# EasyEDA schematic Schematic - EasyEDA.json

## Sheets
1 Upper Schematic: TITLE: TickTockTubeClock - Upper PCB; REV: 1.0; Date: 2020-08-06; Sheet: 1/1; Drawn By: Andreas Tarnowsky; Company: N/A
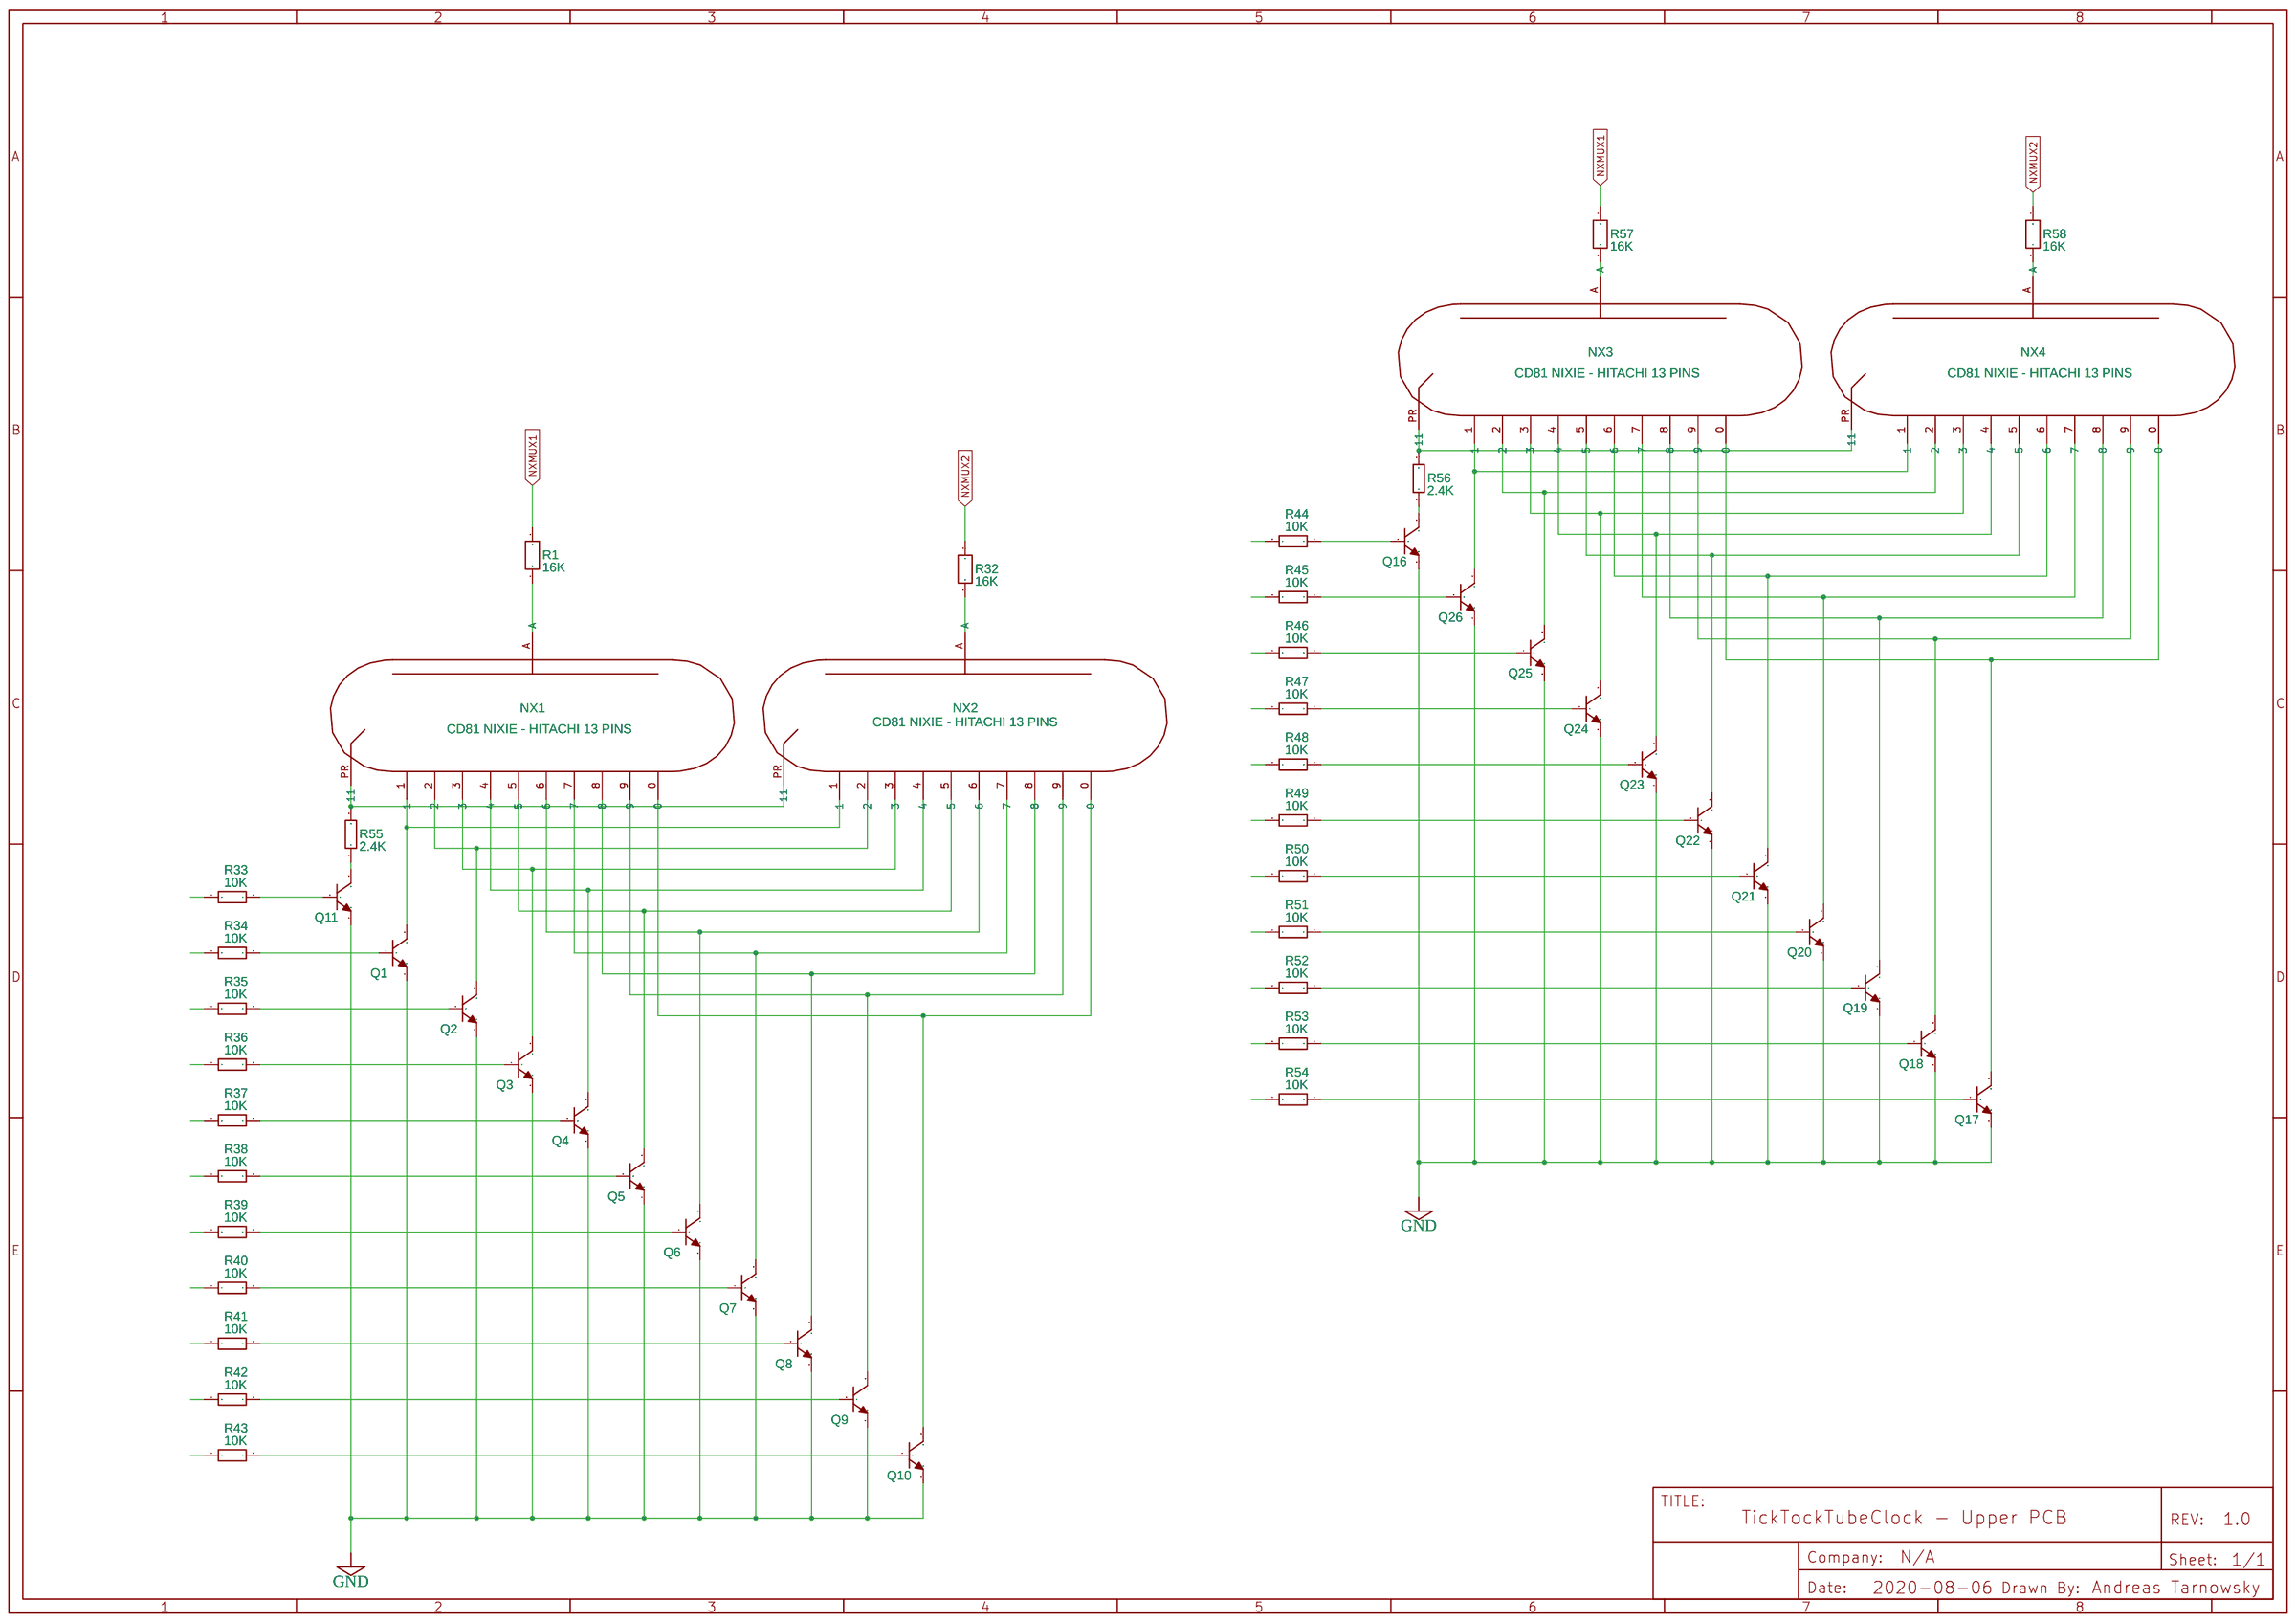
[diagram p0: Upper Schematic]
2 Lower Schematic: TITLE: TickTockTubeClock - Lower PCB; REV: 3.0; Date: 2022-03-27
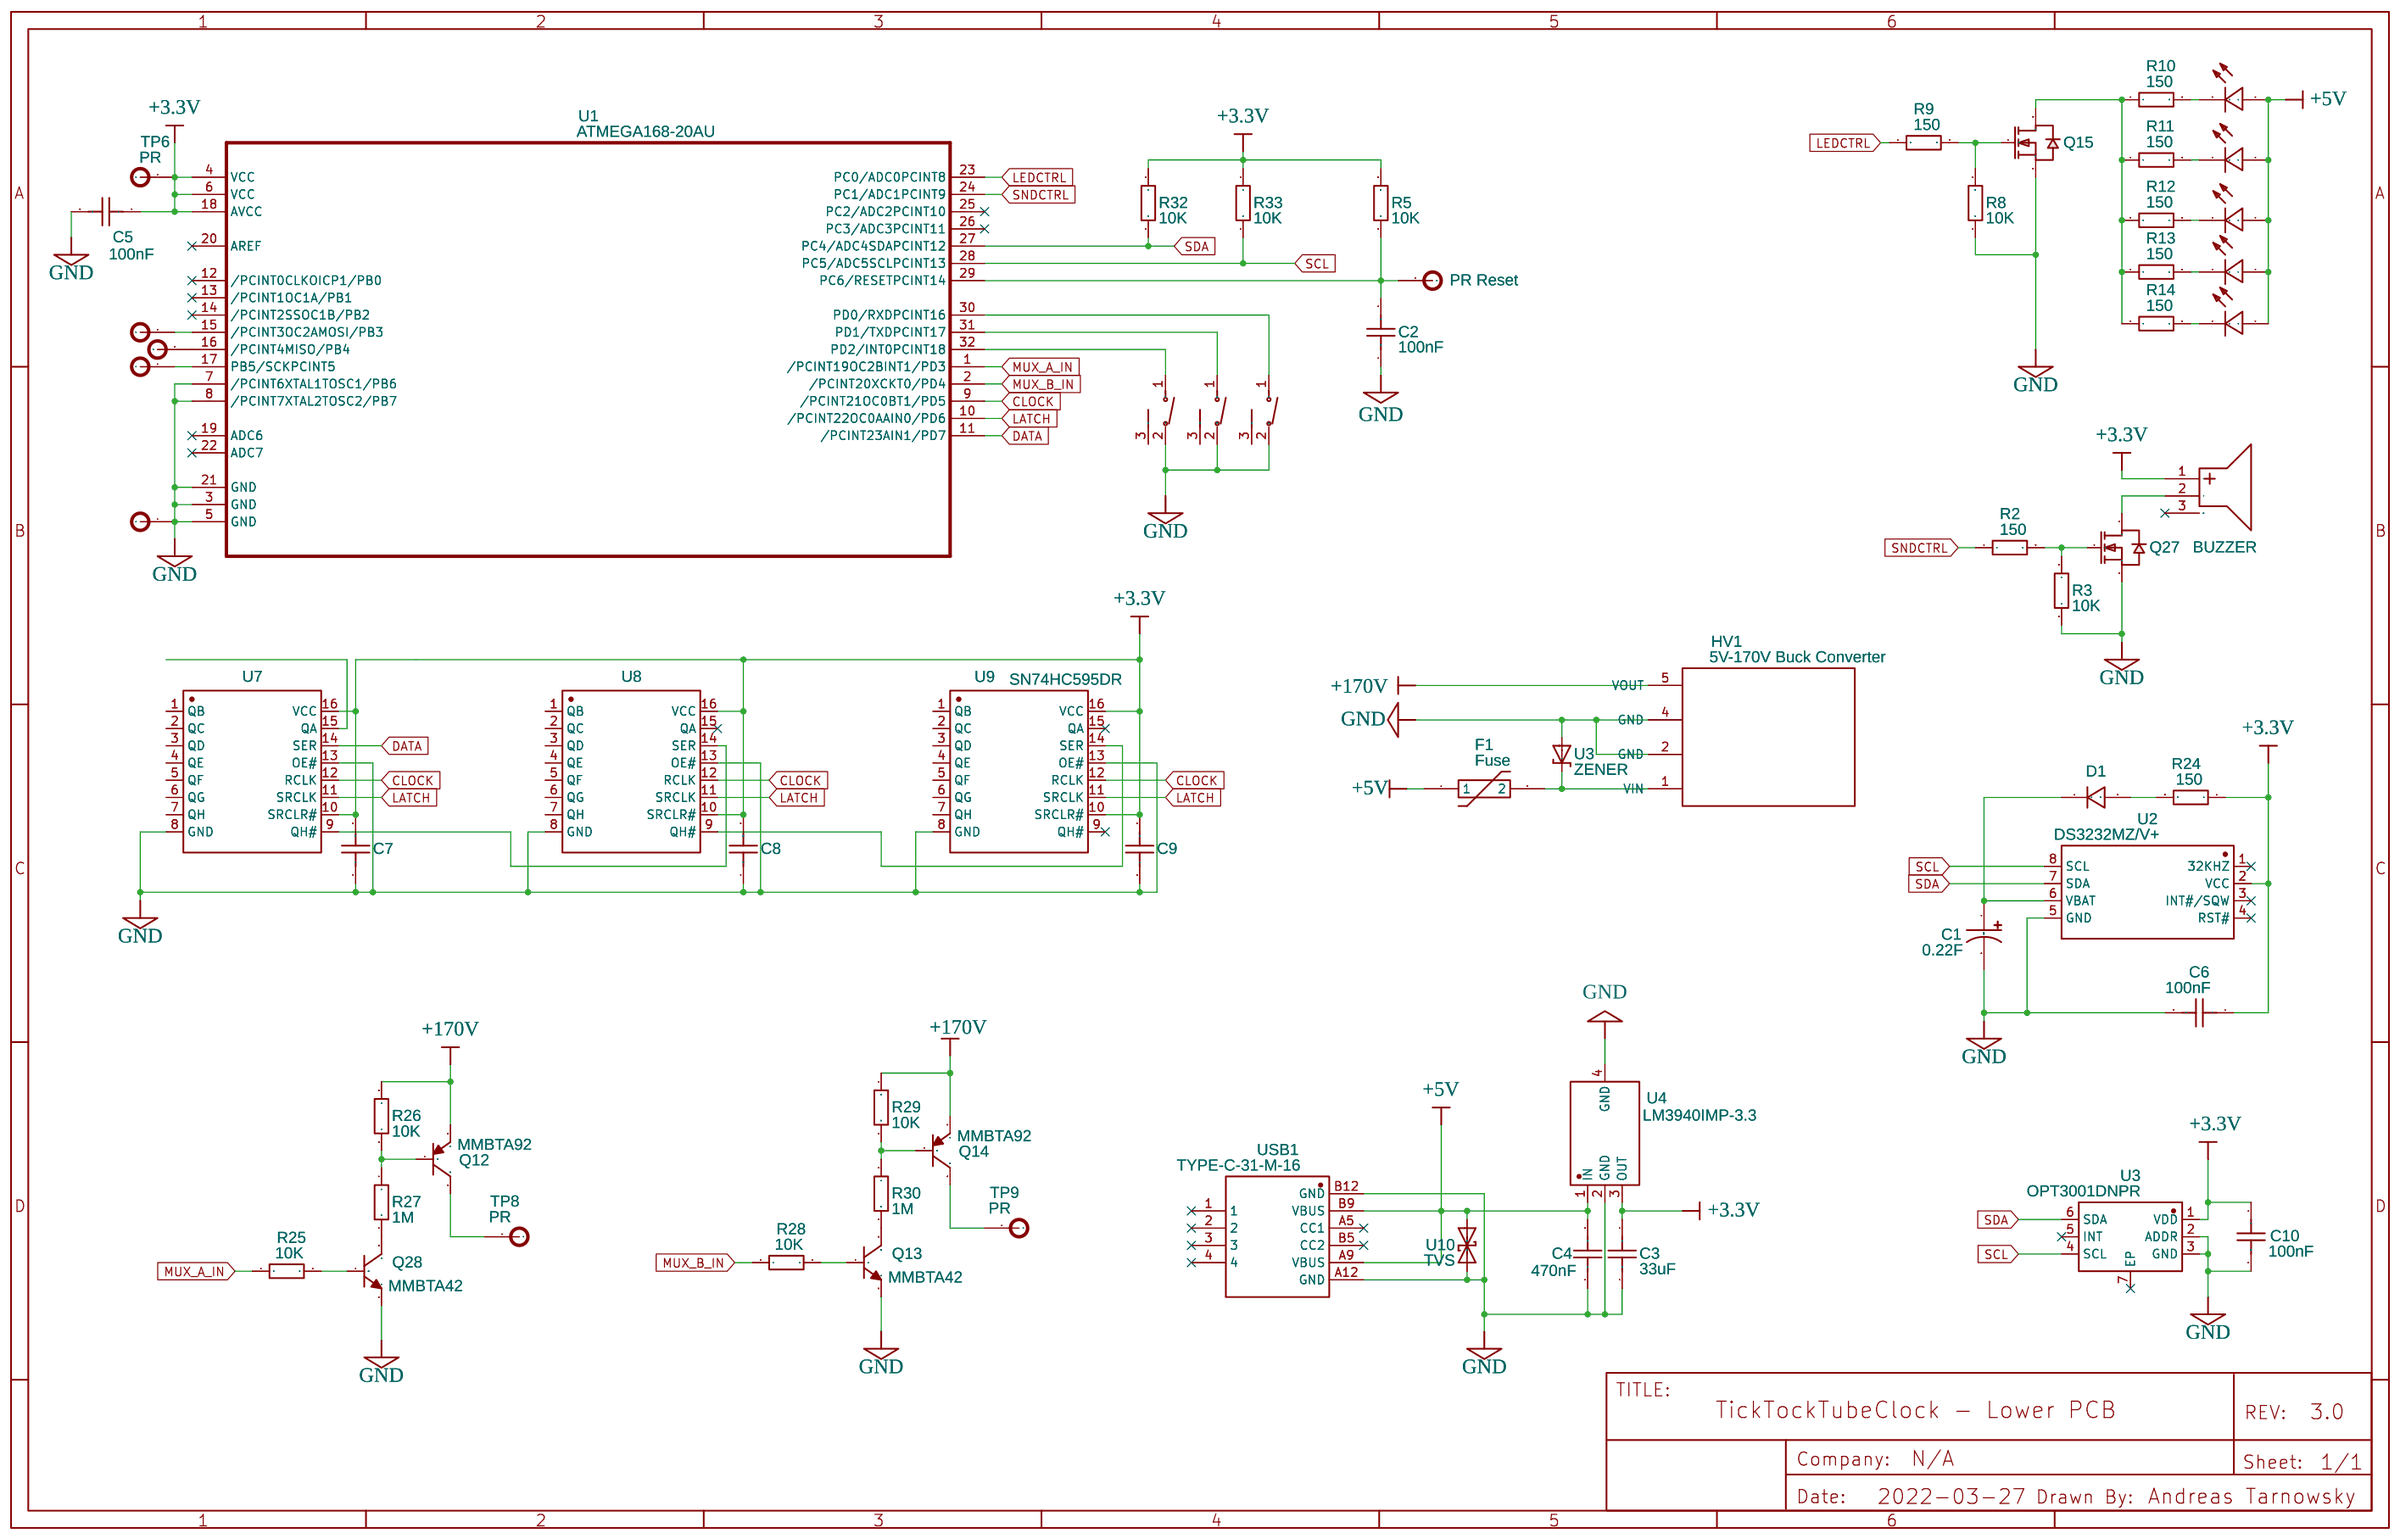
[diagram p1: Lower Schematic]

## Parts
sheet Lower Schematic
BUZZER  KLJ-5018  [BUZ-SMD_4P-L5.0-W5.0-P4.00-BR]
C1  0.22F  [GOLDCAP_SMD_10MM_ROUND]
C2  100nF  [C0603]
C3  33uF  [C1206]
C4  470nF  [C0805]
C5  100nF  [C0603]
C6  100nF  [C0603]
C7  100nF  [C0603]
C8  100nF  [C0603]
C9  100nF  [C0603]
C10  100nF  [C0603]
D1  1N4148W-13-F  [SOD-123_L2.8-W1.8-LS3.7-RD]
F1  Fuse  [LITTELFUSE_0805L100WR]
HV1  5V-170V Buck Converter  [HV_5V_170V_MINI]
LED1  17-21/S2C-FR1S2L/3T  [LED0805-R-RD]
LED2  17-21/S2C-FR1S2L/3T  [LED0805-R-RD]
LED3  17-21/S2C-FR1S2L/3T  [LED0805-R-RD]
LED4  17-21/S2C-FR1S2L/3T  [LED0805-R-RD]
LED5  17-21/S2C-FR1S2L/3T  [LED0805-R-RD]
Q12  MMBTA92  [SOT-23-3_L2.9-W1.3-P1.90-LS2.4-BR]
Q13  MMBTA42  [SOT-23-3_L2.9-W1.3-P1.90-LS2.4-BR]
Q14  MMBTA92  [SOT-23-3_L2.9-W1.3-P1.90-LS2.4-BR]
Q15  IRLML2502TRPBF  [SOT-23_L2.9-W1.3-P0.95-LS2.4-BR]
Q27  IRLML2502TRPBF  [SOT-23_L2.9-W1.3-P0.95-LS2.4-BR]
Q28  MMBTA42  [SOT-23-3_L2.9-W1.3-P1.90-LS2.4-BR]
R2  150  [R0805]
R3  10K  [R0805]
R5  10K  [R0805]
R8  10K  [R0805]
R9  150  [R0805]
R10  150  [R0805]
R11  150  [R0805]
R12  150  [R0805]
R13  150  [R0805]
R14  150  [R0805]
R24  150  [R0805]
R25  10K  [R0805]
R26  10K  [R0805]
R27  1M  [R0805]
R28  10K  [R0805]
R29  10K  [R0805]
R30  1M  [R0805]
R32#2  10K  [R0805]
R33#2  10K  [R0805]
SW1  TCD-C2KQR  [SW-SMD_TCD-C2KQR]
SW2  TCD-C2KQR  [SW-SMD_TCD-C2KQR]
SW3  TCD-C2KQR  [SW-SMD_TCD-C2KQR]
TP1  PR Reset  [TEST_PAD]
TP3  PR  [TEST_PAD]
TP4  PR  [TEST_PAD]
TP5  PR  [TEST_PAD]
TP6  PR  [TEST_PAD]
TP7  PR  [TEST_PAD]
TP8  PR  [TEST_PAD]
TP9  PR  [TEST_PAD]
U1  ATMEGA168-20AU  [TQFP32]
U2  DS3232MZ/V+  [SOIC-8_L4.9-W3.9-P1.27-LS6.0-BL]
U3  OPT3001DNPR  [USON6_L2.1-W2.1-P0.65-BL-EP]
U3#2  ZENER  [DIODE-ZENER]
U4  LM3940IMP-3.3  [SOT-223_L6.5-W3.5-P2.30-LS7.0-BR]
U7  SN74HC595DR  [SOIC-16_L9.9-W3.9-P1.27-LS6.0-BL]
U8  SN74HC595DR  [SOIC-16_L9.9-W3.9-P1.27-LS6.0-BL]
U9  SN74HC595DR  [SOIC-16_L9.9-W3.9-P1.27-LS6.0-BL]
U10  TVS  [SMA-DIODE]
USB1  TYPE-C-31-M-16  [TYPE-C-SMD_TYPE-C-31-M-16]
sheet Upper Schematic
NX1  CD81 NIXIE - HITACHI 13 PINS  [CD81 NIXIE - HITACHI 13PIN]
NX2  CD81 NIXIE - HITACHI 13 PINS  [CD81 NIXIE - HITACHI 13PIN]
NX3  CD81 NIXIE - HITACHI 13 PINS  [CD81 NIXIE - HITACHI 13PIN]
NX4  CD81 NIXIE - HITACHI 13 PINS  [CD81 NIXIE - HITACHI 13PIN]
Q1  MMBTA42  [SOT-23-3_L2.9-W1.6-P1.90-LS2.8-BR]
Q2  MMBTA42  [SOT-23-3_L2.9-W1.6-P1.90-LS2.8-BR]
Q3  MMBTA42  [SOT-23-3_L2.9-W1.6-P1.90-LS2.8-BR]
Q4  MMBTA42  [SOT-23-3_L2.9-W1.6-P1.90-LS2.8-BR]
Q5  MMBTA42  [SOT-23-3_L2.9-W1.6-P1.90-LS2.8-BR]
Q6  MMBTA42  [SOT-23-3_L2.9-W1.6-P1.90-LS2.8-BR]
Q7  MMBTA42  [SOT-23-3_L2.9-W1.6-P1.90-LS2.8-BR]
Q8  MMBTA42  [SOT-23-3_L2.9-W1.6-P1.90-LS2.8-BR]
Q9  MMBTA42  [SOT-23-3_L2.9-W1.6-P1.90-LS2.8-BR]
Q10  MMBTA42  [SOT-23-3_L2.9-W1.6-P1.90-LS2.8-BR]
Q11  MMBTA42  [SOT-23-3_L2.9-W1.6-P1.90-LS2.8-BR]
Q16  MMBTA42  [SOT-23-3_L2.9-W1.6-P1.90-LS2.8-BR]
Q17  MMBTA42  [SOT-23-3_L2.9-W1.6-P1.90-LS2.8-BR]
Q18  MMBTA42  [SOT-23-3_L2.9-W1.6-P1.90-LS2.8-BR]
Q19  MMBTA42  [SOT-23-3_L2.9-W1.6-P1.90-LS2.8-BR]
Q20  MMBTA42  [SOT-23-3_L2.9-W1.6-P1.90-LS2.8-BR]
Q21  MMBTA42  [SOT-23-3_L2.9-W1.6-P1.90-LS2.8-BR]
Q22  MMBTA42  [SOT-23-3_L2.9-W1.6-P1.90-LS2.8-BR]
Q23  MMBTA42  [SOT-23-3_L2.9-W1.6-P1.90-LS2.8-BR]
Q24  MMBTA42  [SOT-23-3_L2.9-W1.6-P1.90-LS2.8-BR]
Q25  MMBTA42  [SOT-23-3_L2.9-W1.6-P1.90-LS2.8-BR]
Q26  MMBTA42  [SOT-23-3_L2.9-W1.6-P1.90-LS2.8-BR]
R1  16K  [R0805]
R32  16K  [R0805]
R33  10K  [R0603]
R34  10K  [R0603]
R35  10K  [R0603]
R36  10K  [R0603]
R37  10K  [R0603]
R38  10K  [R0603]
R39  10K  [R0603]
R40  10K  [R0603]
R41  10K  [R0603]
R42  10K  [R0603]
R43  10K  [R0603]
R44  10K  [R0603]
R45  10K  [R0603]
R46  10K  [R0603]
R47  10K  [R0603]
R48  10K  [R0603]
R49  10K  [R0603]
R50  10K  [R0603]
R51  10K  [R0603]
R52  10K  [R0603]
R53  10K  [R0603]
R54  10K  [R0603]
R55  2.4K  [R0805]
R56  2.4K  [R0805]
R57  16K  [R0805]
R58  16K  [R0805]

## Library data of the parts
BUZZER = KLJ-5018: Supplier: Digi-Key; Supplier Part: 102-3743-1-ND; Manufacturer: CMT; Manufacturer Part: CMT-5023S-SMT-TR; Contributor: LCSC
C1 = GOLD-CAP MATSUSHITA GC5.5V0.10F: Manufacturer: Matsushita; Contributor: LCSC
C2 C5-C10 = C0603C104J5RAC: Supplier: LCSC; Supplier Part: C490602; Manufacturer: KEMET; Contributor: LCSC
C3 = C3216X5R1A336MTJ00N: Supplier: LCSC; Supplier Part: C342606; Manufacturer: TDK; Contributor: LCSC
C4 = GCM21BR71H474MA55L: Supplier: LCSC; Supplier Part: C161264; Manufacturer: Murata Electronics; Contributor: LCSC
D1 = 1N4148W-13-F: Supplier Part: C112342; Supplier: LCSC; Manufacturer: DIODES; Contributor: LCSC
F1 = Littelfuse 0805L100WR: Manufacturer: Littelfuse; Manufacturer Part: 0805L100WR; Supplier: LCSC; Supplier Part: C80270; link: https://lcsc.com/product-detail/Others_Littelfuse_0805L100WR_Littelfuse-0805L100WR_C80270.html; Contributor: EddieT76
HV1 = 5V-170V Buck Converter: Contributor: andreas.tarnowsky
LED1-LED5 = 17-21/S2C-FR1S2L/3T: Supplier: LCSC; Supplier Part: C264419; Manufacturer: Everlight Elec; Contributor: LCSC
Q12 Q14 = MMBTA92 2D: Supplier: LCSC; Manufacturer: CJ; image: //image.lceda.cn/szlcsc/C8516.jpg; Supplier Part: C8516; LCSC Assembly: Yes; SMT Type: Extend
Q13 Q28 = MMBTA42_C8515: Supplier: LCSC; Manufacturer: CJ; image: //image.lceda.cn/szlcsc/C8515.jpg; Supplier Part: C8515; LCSC Assembly: Yes; SMT Type: Extend
Q15 Q27 = IRLML2502TRPBF: Supplier: LCSC; Manufacturer: IR; image: //image.lceda.cn/szlcsc/C2589.jpg; Supplier Part: C2589; SMT Type: Extend; JLCPCB SMD: Yes
R2 R9-R14 = RMC08051501%N: Supplier: LCSC; Supplier Part: C325766; Manufacturer: Tyohm; Contributor: LCSC
R3 R5 R8 R25 R26 R28 R29 R32#2 R33#2 = 0805W8F1002T5E: Supplier: LCSC; Manufacturer: UniOhm; LCSC Assembly: Yes; Supplier Part: C17414; SMT Type: Basic
R24 = 0805W8F2400T5E: Supplier: LCSC; Manufacturer: UniOhm; LCSC Assembly: Yes; Supplier Part: C17572; SMT Type: Basic
R27 R30 = 0805W8F1002T5E: Supplier: LCSC; Manufacturer Part: 0805W8F1004T5E; Supplier Part: C17514; Manufacturer: UniOhm
SW1-SW3 = TCD-C2KQR: Supplier: LCSC; Supplier Part: C483805; Manufacturer: Diptronics; Contributor: LCSC
TP1 TP3-TP9 = Test Point Small: Manufacturer Part: Test_Pin; Contributor: linuxlism
U1 = ATMEGA168-20AU
U2 = DS3232MZ/V+: Supplier: LCSC; Manufacturer: MAXIM; Contributor: LCSC; Supplier Part: C143316; LCSC Assembly: Yes; SMT Type: Extend
U3 = OPT3001DNPR: Supplier: LCSC; Manufacturer: TI; Supplier Part: C90462; SMT Type: Extend; JLCPCB SMD: Yes
U3#2 = DIODE-ZENER: Contributor: SparkFun
U4 = LM3940IMP-3.3/NOPB: Supplier: LCSC; Supplier Part: C140319; Manufacturer: Texas Instruments; Contributor: LCSC; SMT Type: Extend; JLCPCB SMD: Yes
U7-U9 = SN74HC595DR: Supplier: LCSC; Manufacturer: TI; image: //image.lceda.cn/szlcsc/C10092.jpg; Supplier Part: C10092; SMT Type: Extend; JLCPCB SMD: Yes
U10 = TVS: Contributor: SparkFun
USB1 = TYPE-C-31-M-16: Supplier: LCSC; Supplier Part: C283541; Manufacturer: Korean Hroparts Elec; Contributor: LCSC
NX1-NX4 = CD81 NIXIE - HITACHI 13 PINS: Contributor: TomekZi
Q1-Q11 Q16-Q26 = MMBTA42LT1G: Supplier: LCSC; Manufacturer: ON; Supplier Part: C94389; LCSC Assembly: Yes; SMT Type: Extend
R1 R32 R57 R58 = ERJ6GEYJ163V: Supplier: LCSC; Supplier Part: C413203; Manufacturer: PANASONIC; Contributor: LCSC
R33-R54 = ERJPB3D1002V: Supplier: LCSC; Supplier Part: C189495; Manufacturer: PANASONIC; Contributor: LCSC
R55 R56 = ERJ6RBD2401V: Supplier: LCSC; Supplier Part: C336868; Manufacturer: PANASONIC; Contributor: LCSC

## Nets
+3.3V: BUZZER.1(+) C3.2 C5.1 C6.1 C7.2 C8.2 C9.2 C10.1 R5.2 R24.1 R32#2.2 R33#2.2 TP6.1 U1.4(VCC) U1.6(VCC) U1.18(AVCC) U2.2(VCC) U3.1(VDD) U4.3(OUT) U7.10(SRCLR#) U7.16(VCC) U8.10(SRCLR#) U8.16(VCC) U9.10(SRCLR#) U9.16(VCC)
+5V: C4.2 F1.1 LED1.1(A) LED2.1(A) LED3.1(A) LED4.1(A) LED5.1(A) U4.1(IN) U10.C(2) USB1.A9(VBUS) USB1.B9(VBUS)
+170V: HV1.5(VOUT) Q12.2(E) Q14.2(E) R26.1 R29.1
GND: C1.2 C2.1 C3.1 C4.1 C5.2 C6.2 C7.1 C8.1 C9.1 C10.2 HV1.2(GND) HV1.4(GND) Q1.2 Q2.2 Q3.2 Q4.2 Q5.2 Q6.2 Q7.2 Q8.2 Q9.2 Q10.2 Q11.2 Q13.2(E) Q15.2(S) Q16.2 Q17.2 Q18.2 Q19.2 Q20.2 Q21.2 Q22.2 Q23.2 Q24.2 Q25.2 Q26.2 Q27.2(S) Q28.2(E) R3.1 R8.1 SW1.2 SW2.2 SW3.2 TP7.1 U1.3(GND) U1.5(GND) U1.7(/PCINT6XTAL1TOSC1/PB6) U1.8(/PCINT7XTAL2TOSC2/PB7) U1.21(GND) U2.5(GND) U3.2(ADDR) U3.3(GND) U3#2.P$2(A) U4.2(GND) U4.4(GND) U7.8(GND) U7.13(OE#) U8.8(GND) U8.13(OE#) U9.8(GND) U9.13(OE#) U10.A(1) USB1.A12(GND) USB1.B12(GND)
CLOCK: U1.9(/PCINT21OC0BT1/PD5) U7.12(RCLK) U8.12(RCLK) U9.12(RCLK)
DATA: U1.11(/PCINT23AIN1/PD7) U7.14(SER)
LATCH: U1.10(/PCINT22OC0AAIN0/PD6) U7.11(SRCLK) U8.11(SRCLK) U9.11(SRCLK)
LEDCTRL: R9.1 U1.23(PC0/ADC0PCINT8)
MUX_A_IN: R25.1 U1.1(/PCINT19OC2BINT1/PD3)
MUX_B_IN: R28.1 U1.2(/PCINT20XCKT0/PD4)
NXMUX1: R1.2 R57.2
NXMUX2: R32.2 R58.2
SCL: R33#2.1 U1.28(PC5/ADC5SCLPCINT13) U2.8(SCL) U3.4(SCL)
SDA: R32#2.1 U1.27(PC4/ADC4SDAPCINT12) U2.7(SDA) U3.6(SDA)
SNDCTRL: R2.1 U1.24(PC1/ADC1PCINT9)
Net-(BUZZER-2): BUZZER.2(-) Q27.3(D)
Net-(C1-1): C1.1 D1.1 U2.6(VBAT)
Net-(C2-2): C2.2 R5.1 TP1.1 U1.29(PC6/RESETPCINT14)
Net-(D1-2): D1.2 R24.2
Net-(F1-2): F1.2 U3#2.P$1(C)
Net-(LED1-2): LED1.2(K) R10.2
Net-(LED2-2): LED2.2(K) R11.2
Net-(LED3-2): LED3.2(K) R12.2
Net-(LED4-2): LED4.2(K) R13.2
Net-(LED5-2): LED5.2(K) R14.2
Net-(NX1-0): NX1.0 NX2.0 Q10.3
Net-(NX1-1): NX1.1 NX2.1 Q1.3
Net-(NX1-2): NX1.2 NX2.2 Q2.3
Net-(NX1-3): NX1.3 NX2.3 Q3.3
Net-(NX1-4): NX1.4 NX2.4 Q4.3
Net-(NX1-5): NX1.5 NX2.5 Q5.3
Net-(NX1-6): NX1.6 NX2.6 Q6.3
Net-(NX1-7): NX1.7 NX2.7 Q7.3
Net-(NX1-8): NX1.8 NX2.8 Q8.3
Net-(NX1-9): NX1.9 NX2.9 Q9.3
Net-(NX1-A): NX1.A R1.1
Net-(NX1-PR): NX1.PR(11) NX2.PR(11) R55.2
Net-(NX2-A): NX2.A R32.1
Net-(NX3-0): NX3.0 NX4.0 Q17.3
Net-(NX3-1): NX3.1 NX4.1 Q26.3
Net-(NX3-2): NX3.2 NX4.2 Q25.3
Net-(NX3-3): NX3.3 NX4.3 Q24.3
Net-(NX3-4): NX3.4 NX4.4 Q23.3
Net-(NX3-5): NX3.5 NX4.5 Q22.3
Net-(NX3-6): NX3.6 NX4.6 Q21.3
Net-(NX3-7): NX3.7 NX4.7 Q20.3
Net-(NX3-8): NX3.8 NX4.8 Q19.3
Net-(NX3-9): NX3.9 NX4.9 Q18.3
Net-(NX3-A): NX3.A R57.1
Net-(NX3-PR): NX3.PR(11) NX4.PR(11) R56.2
Net-(NX4-A): NX4.A R58.1
Net-(Q1-1): Q1.1 R34.2
Net-(Q2-1): Q2.1 R35.2
Net-(Q3-1): Q3.1 R36.2
Net-(Q4-1): Q4.1 R37.2
Net-(Q5-1): Q5.1 R38.2
Net-(Q6-1): Q6.1 R39.2
Net-(Q7-1): Q7.1 R40.2
Net-(Q8-1): Q8.1 R41.2
Net-(Q9-1): Q9.1 R42.2
Net-(Q10-1): Q10.1 R43.2
Net-(Q11-1): Q11.1 R33.2
Net-(Q11-3): Q11.3 R55.1
Net-(Q12-1): Q12.1(B) R26.2 R27.1
Net-(Q12-3): Q12.3(C) TP8.1
Net-(Q13-1): Q13.1(B) R28.2
Net-(Q13-3): Q13.3(C) R30.2
Net-(Q14-1): Q14.1(B) R29.2 R30.1
Net-(Q14-3): Q14.3(C) TP9.1
Net-(Q15-1): Q15.1(G) R8.2 R9.2
Net-(Q15-3): Q15.3(D) R10.1 R11.1 R12.1 R13.1 R14.1
Net-(Q16-1): Q16.1 R44.2
Net-(Q16-3): Q16.3 R56.1
Net-(Q17-1): Q17.1 R54.2
Net-(Q18-1): Q18.1 R53.2
Net-(Q19-1): Q19.1 R52.2
Net-(Q20-1): Q20.1 R51.2
Net-(Q21-1): Q21.1 R50.2
Net-(Q22-1): Q22.1 R49.2
Net-(Q23-1): Q23.1 R48.2
Net-(Q24-1): Q24.1 R47.2
Net-(Q25-1): Q25.1 R46.2
Net-(Q26-1): Q26.1 R45.2
Net-(Q27-1): Q27.1(G) R2.2 R3.2
Net-(Q28-1): Q28.1(B) R25.2
Net-(Q28-3): Q28.3(C) R27.2
Net-(SW1-1): SW1.1 U1.31(PD1/TXDPCINT17)
Net-(SW2-1): SW2.1 U1.32(PD2/INT0PCINT18)
Net-(SW3-1): SW3.1 U1.30(PD0/RXDPCINT16)
Net-(TP3-1): TP3.1 U1.17(PB5/SCKPCINT5)
Net-(TP4-1): TP4.1 U1.16(/PCINT4MISO/PB4)
Net-(TP5-1): TP5.1 U1.15(/PCINT3OC2AMOSI/PB3)
Net-(U7-9): U7.9(QH#) U8.14(SER)
Net-(U8-9): U8.9(QH#) U9.14(SER)

Not connected (* = marked no-connect by the designer): BUZZER 3*; HV1 1(VIN); R33 1; R34 1; R35 1; R36 1; R37 1; R38 1; R39 1; R40 1; R41 1; R42 1; R43 1; R44 1; R45 1; R46 1; R47 1; R48 1; R49 1; R50 1; R51 1; R52 1; R53 1; R54 1; SW1 3; SW2 3; SW3 3; U1 12(/PCINT0CLKOICP1/PB0)* 13(/PCINT1OC1A/PB1)* 14(/PCINT2SSOC1B/PB2)* 19(ADC6)* 20(AREF)* 22(ADC7)* 25(PC2/ADC2PCINT10)* 26(PC3/ADC3PCINT11)*; U2 1(32KHZ)* 3(INT#/SQW)* 4(RST#)*; U3 5(INT)* 7(EP)*; U7 1(QB) 2(QC) 3(QD) 4(QE) 5(QF) 6(QG) 7(QH) 15(QA); U8 1(QB) 2(QC) 3(QD) 4(QE) 5(QF) 6(QG) 7(QH) 15(QA)*; U9 1(QB) 2(QC) 3(QD) 4(QE) 5(QF) 6(QG) 7(QH) 9(QH#)* 15(QA)*; USB1 1* 2* 3* 4* A5(CC1)* B5(CC2)*
